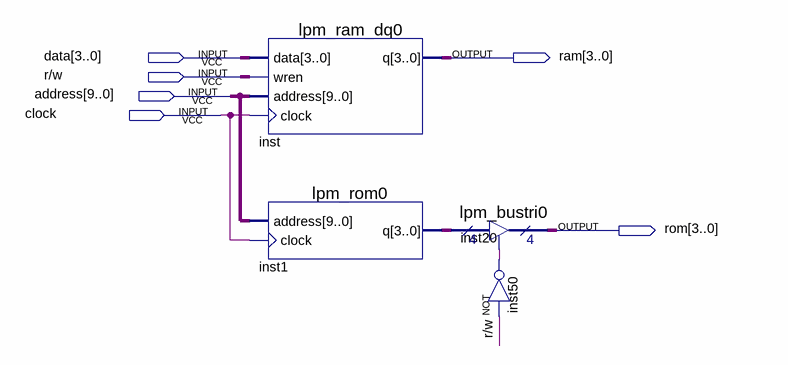
[diagram p0: schematic sheet]
// Quartus schematic Memory.bdf as structural Verilog: 4 symbols, 6 pins
module Memory (
  input  [3:0] data,
  input  \r/w ,
  input  [9:0] address,
  input  clock,
  output [3:0] ram,
  output [3:0] rom
);

  wire inst50_out;
  wire [3:0] inst1_q;

  lpm_ram_dq0 inst (.data(data), .wren(\r/w ), .address(address), .clock(clock), .q(ram));
  lpm_rom0 inst1 (.address(address), .clock(clock), .q(inst1_q));
  lpm_bustri0 inst20 (.enabledt(inst50_out), .data(inst1_q), .tridata(rom));
  not inst50 (inst50_out, \r/w );
endmodule
